# EAGLE schematic Underwater-Camera-v2.0 (EAGLE 9.4.0)

## Sheet 1 of 2
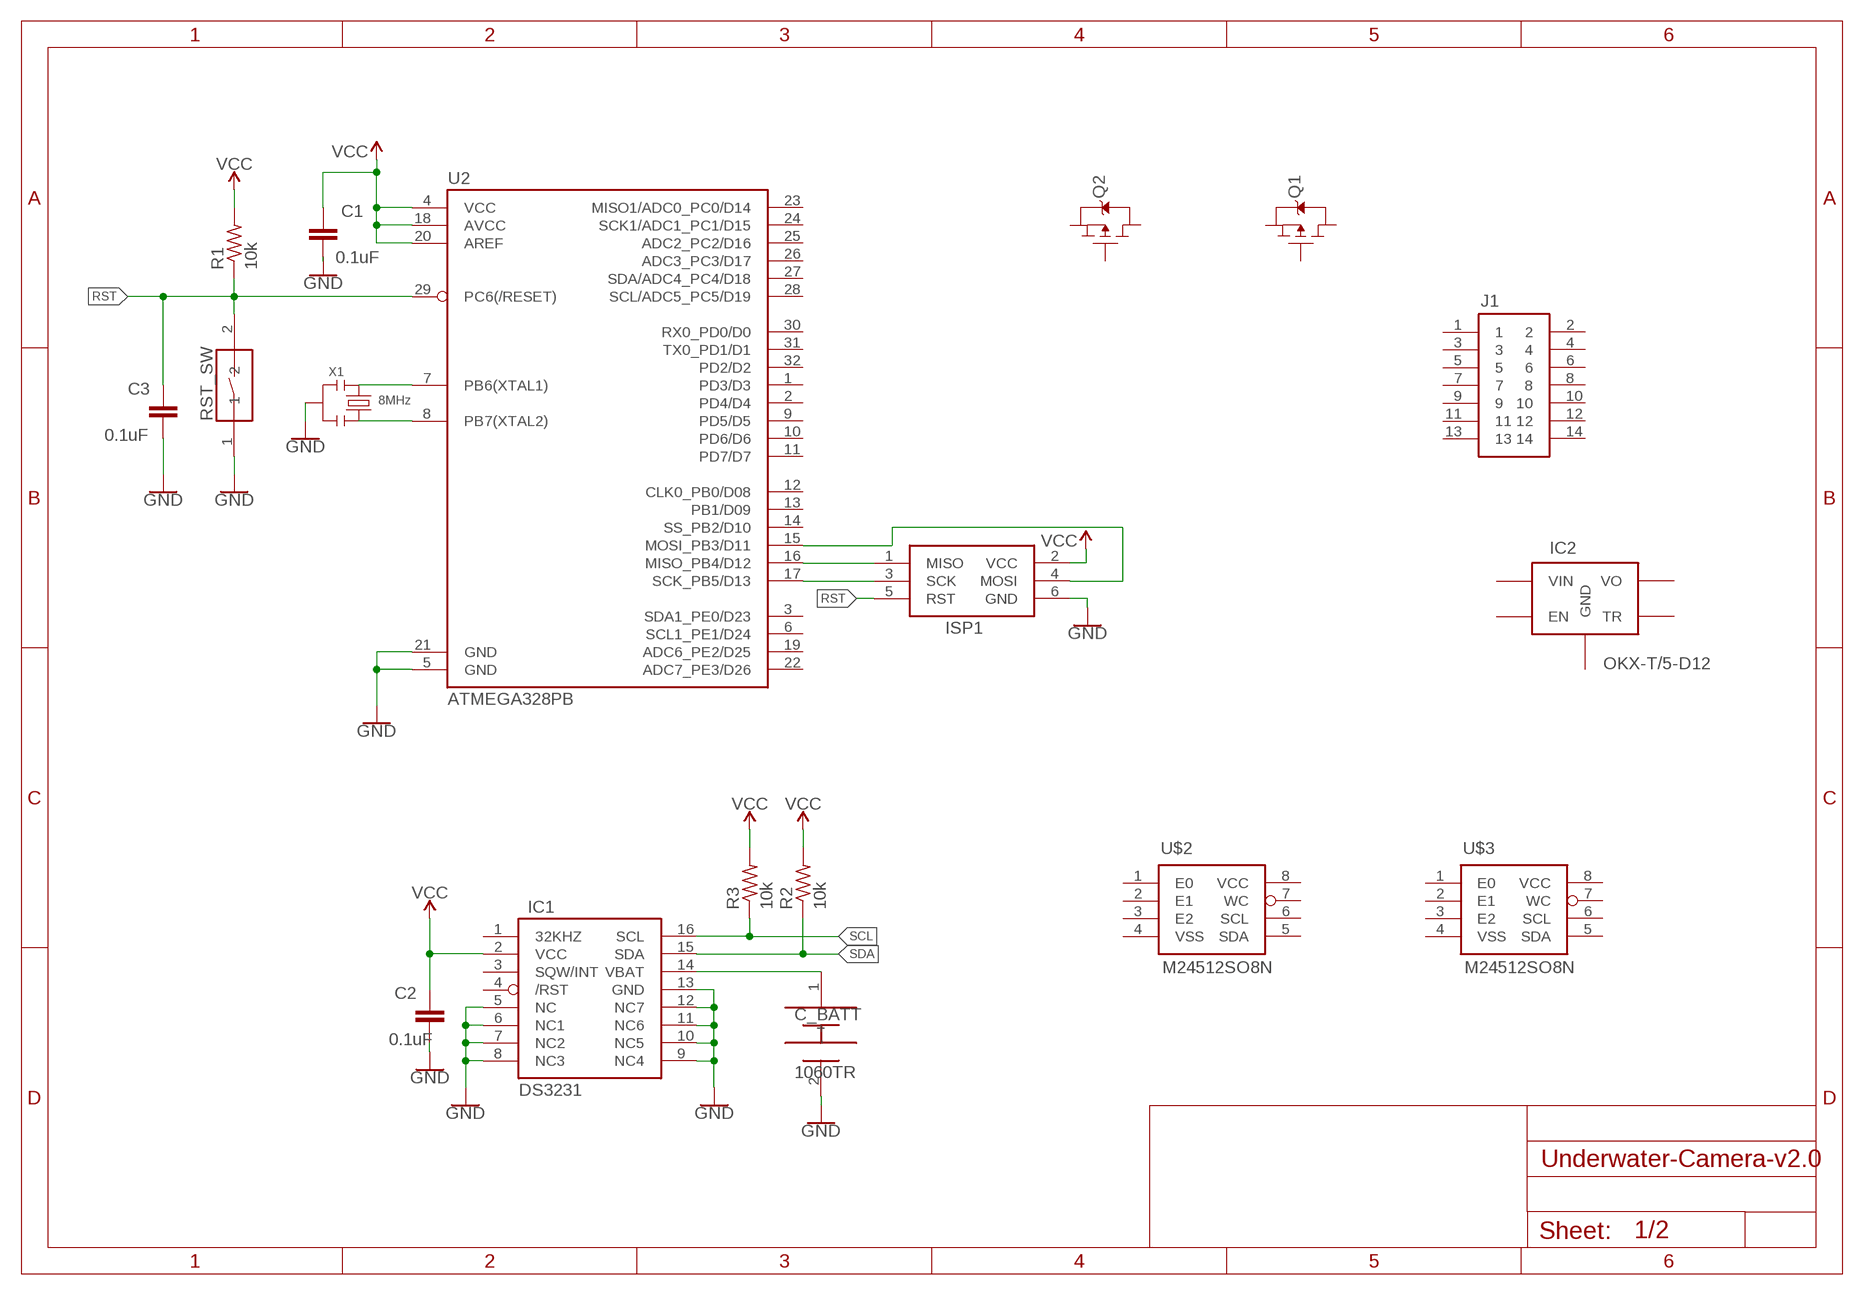
[diagram p0: schematic, sheet 1]

### Parts
C1  0.1uF  CAPACITOR_CERAMIC0603  [CAPC1608X50]
C2  0.1uF  CAPACITOR_CERAMIC0603  [CAPC1608X50]
C3  0.1uF  CAPACITOR_CERAMIC0603  [CAPC1608X50]
C_BATT  1060TR  [RESC26736X10]
IC1  DS3231SOIC-16  [SOIC127P1135X265-16]
IC2  OKX-T/5-D12  [HDRV9W64P254_1X9_2290X508X838B]
ISP1  AVR_ISPHDR2X3  [HDRV6W64P254_2X3_1016X508X838B]
J1  HDR2X7HDR2X7  [HDRV14W64P254_2X7_1778X508X838B]
Q1  DMG2305UXSOT23  [SOT95P240X110-3]
Q2  DMG2305UXSOT23  [SOT95P240X110-3]
R1  10k  RESISTOR0603  [RESC1608X50]
R2  10k  RESISTOR0603  [RESC1608X50]
R3  10k  RESISTOR0603  [RESC1608X50]
RST_SW  SWITCHB3U-1000P  [BEADC4225X160]
U2  ATMEGA328PB  ATMEGA328P  [QFP80P900X900X120-32]
U$2  M24512SO8N  [SOIC127P600X175-8]
U$3  M24512SO8N  [SOIC127P600X175-8]
X1  8MHz  CERAMIC_RESONATOR  [RESCAXE120P320X130X70-6]

### Nets
GND: C1.2 C2.2 C3.2 C_BATT.2(-) IC1.5(NC) IC1.6(NC1) IC1.7(NC2) IC1.8(NC3) IC1.9(NC4) IC1.10(NC5) IC1.11(NC6) IC1.12(NC7) IC1.13(GND) ISP1.6(GND) RST_SW.1 U2.5(GND) U2.21(GND) X1.2 X1.5
N$1: U2.7(PB6(XTAL1)) X1.1 X1.6
N$2: U2.8(PB7(XTAL2)) X1.3 X1.4
N$3: ISP1.3(SCK) U2.17(SCK_PB5/D13)
N$4: ISP1.1(MISO) U2.16(MISO_PB4/D12)
N$5: ISP1.4(MOSI) U2.15(MOSI_PB3/D11)
N$6: C_BATT.1(+) IC1.14(VBAT)
RST: C3.1 ISP1.5(RST) R1.1 RST_SW.2 U2.29(PC6(/RESET))
SCL: IC1.16(SCL) R3.1
SDA: IC1.15(SDA) R2.1
VCC: C1.1 C2.1 IC1.2(VCC) ISP1.2(VCC) R1.2 R2.2 R3.2 U2.4(VCC) U2.18(AVCC) U2.20(AREF)
Unconnected: IC1.1(32KHZ) IC1.3(SQW/INT) IC1.4(/RST) IC2.1(VO) IC2.2(TR) IC2.3(GND) IC2.8(VIN) IC2.9(EN) J1.1 J1.2 J1.3 J1.4 J1.5 J1.6 J1.7 J1.8 J1.9 J1.10 J1.11 J1.12 J1.13 J1.14 Q1.1(G) Q1.2(S) Q1.3(D) Q2.1(G) Q2.2(S) Q2.3(D) U2.1(PD3/D3) U2.2(PD4/D4) U2.3(SDA1_PE0/D23) U2.6(SCL1_PE1/D24) U2.9(PD5/D5) U2.10(PD6/D6) U2.11(PD7/D7) U2.12(CLK0_PB0/D08) U2.13(PB1/D09) U2.14(SS_PB2/D10) U2.19(ADC6_PE2/D25) U2.22(ADC7_PE3/D26) U2.23(MISO1/ADC0_PC0/D14) U2.24(SCK1/ADC1_PC1/D15) U2.25(ADC2_PC2/D16) U2.26(ADC3_PC3/D17) U2.27(SDA/ADC4_PC4/D18) U2.28(SCL/ADC5_PC5/D19) U2.30(RX0_PD0/D0) U2.31(TX0_PD1/D1) U2.32(PD2/D2) U$2.1(E0) U$2.2(E1) U$2.3(E2) U$2.4(VSS) U$2.5(SDA) U$2.6(SCL) U$2.7(WC) U$2.8(VCC) U$3.1(E0) U$3.2(E1) U$3.3(E2) U$3.4(VSS) U$3.5(SDA) U$3.6(SCL) U$3.7(WC) U$3.8(VCC)

## Sheet 2 of 2
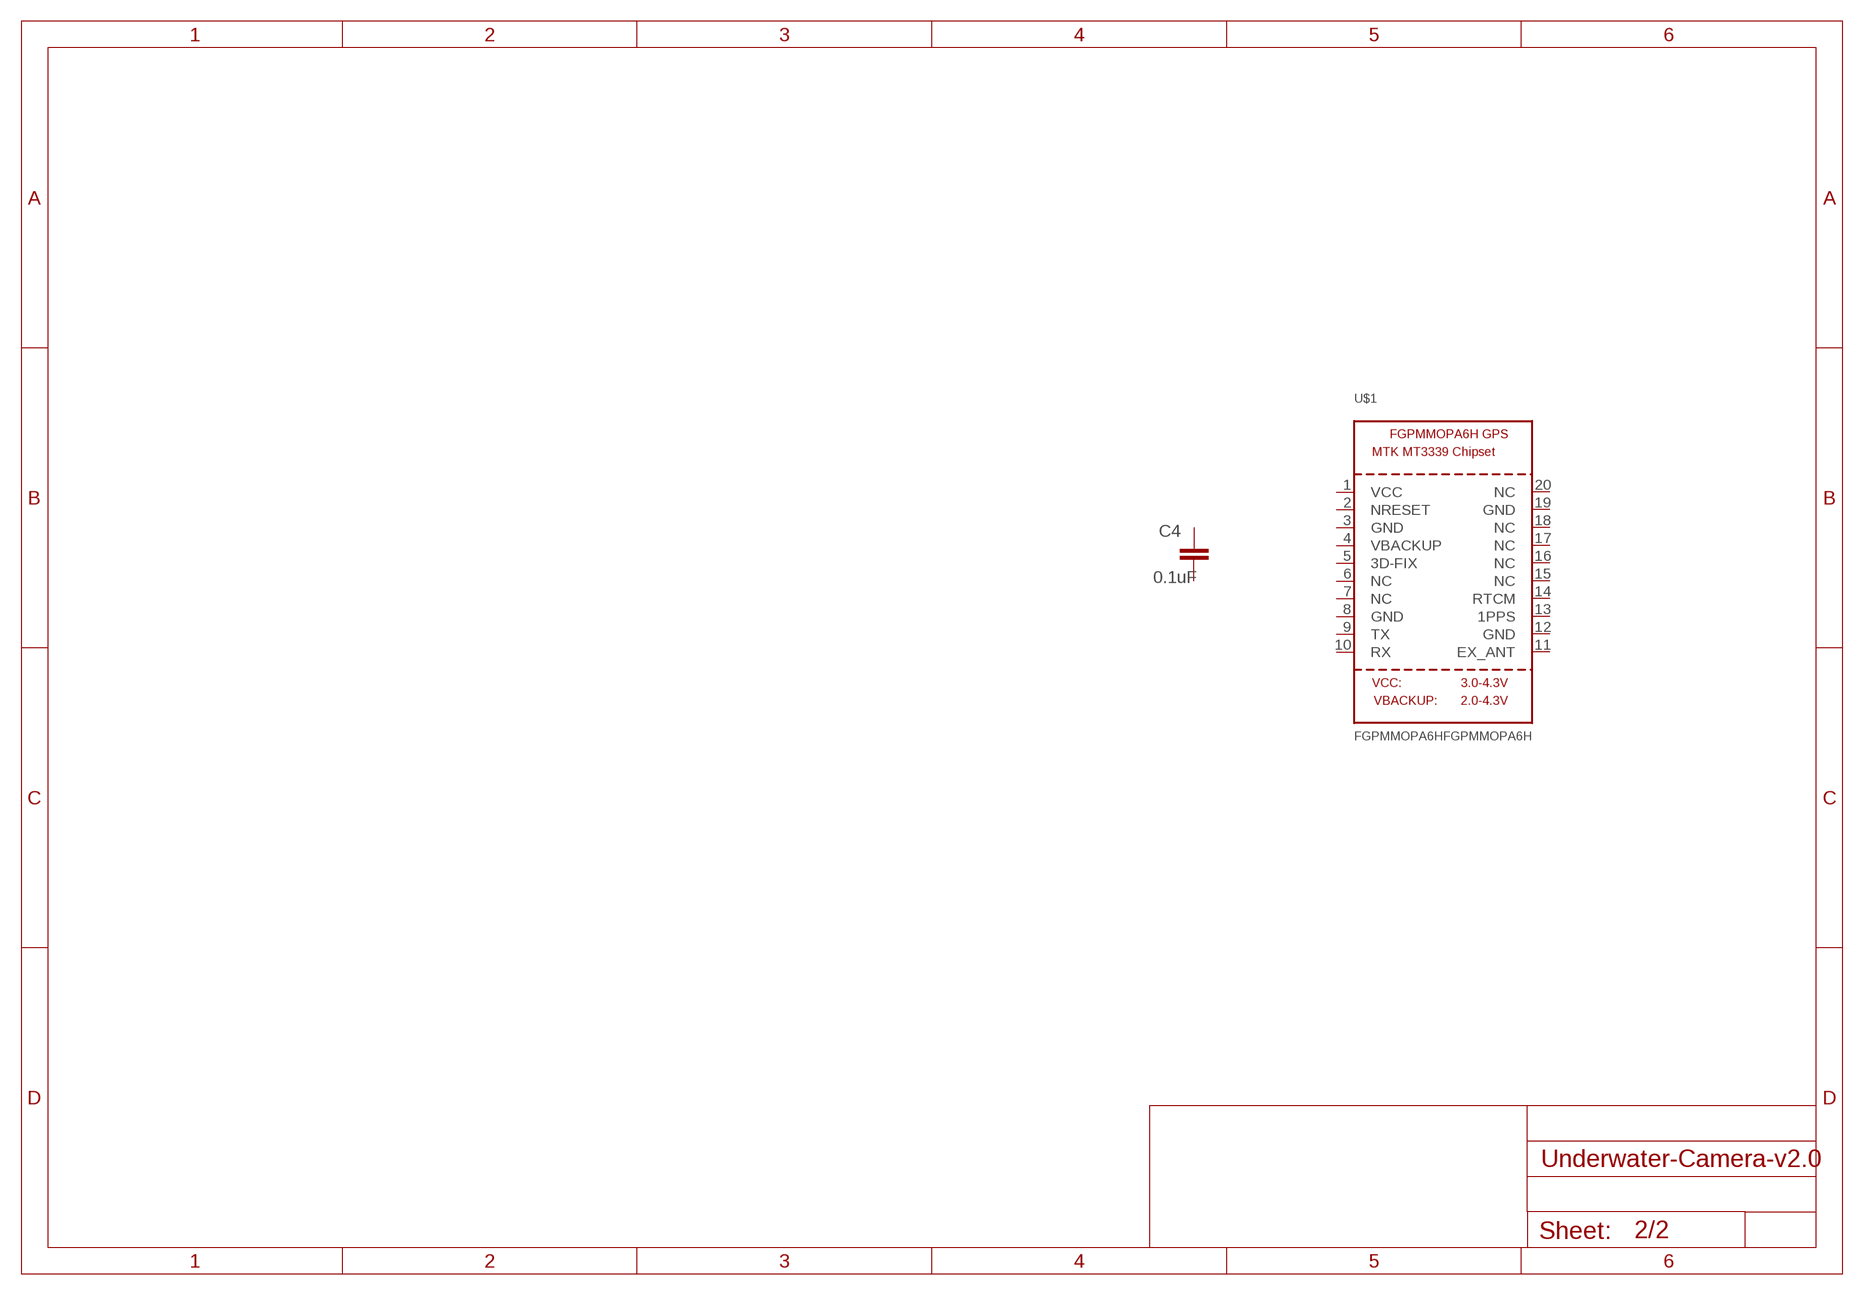
[diagram p1: schematic, sheet 2]

### Parts
C4  0.1uF  CAPACITOR_CERAMIC0603  [CAPC1608X50]
U$1  FGPMMOPA6HFGPMMOPA6H  [SON150P1800X1800X500-20]
Unconnected: C4.1 C4.2 U$1.1(VCC) U$1.2(NRESET) U$1.3(GND) U$1.4(VBACKUP) U$1.5(3D-FIX) U$1.6(NC) U$1.7(NC) U$1.8(GND) U$1.9(TX) U$1.10(RX) U$1.11(EX_ANT) U$1.12(GND) U$1.13(1PPS) U$1.14(RTCM) U$1.15(NC) U$1.16(NC) U$1.17(NC) U$1.18(NC) U$1.19(GND) U$1.20(NC)

## Library data of the parts
C1-C4 = Underwater-Camera-v2.0:CAPACITOR_CERAMIC: Ceramic Capacitor MLCC - Symbol US
C_BATT = Underwater-Camera-v2.0:1060TR: CR2032 Coin Cell Battery Holder
IC1 = Underwater-Camera-v2.0:DS3231: The DS3231 is a low-cost, extremely accurate I2C real-time clock (RTC) with an integrated temperaturecompensated crystal oscillator (TCXO) and crystal.
IC2 = Underwater-Camera-v2.0:OKX-T/5-D12: OKX-T/5-D12 by Murata Inc. - Monolithic DC/DC Converter input: 8.3-13.8v output: <5.5v adjustable current: 5A power: 25W
ISP1 = Underwater-Camera-v2.0:AVR_ISP: AVR ISP PROGRAMMING HEADER
J1 = Underwater-Camera-v2.0:HDR2X7
Q1 Q2 = Underwater-Camera-v2.0:DMG2305UX: DMG2305UX-13 Diodes Incorporated MOSFET P-CH 20V 4.2A SOT23
R1-R3 = Underwater-Camera-v2.0:RESISTOR: Resistor US
RST_SW = Underwater-Camera-v2.0:SWITCH: SWITCH SPST
U2 = Underwater-Camera-v2.0:ATMEGA328P: IC MCU 8BIT 32KB FLASH 32TQFP
U$1 = Underwater-Camera-v2.0:FGPMMOPA6H: -165 dBm sensitivity, 10 Hz updates, 66 channels Ultra low power usage: 20mA current draw while tracking 3.3V operation RTC battery-compatible Built-in datalogging PPS output on fix We have received reports that it works up to ~32Km altitude (the GPS theoretically does not have a limit until 40Km) Internal patch antenna + connection for optional external active antenna Fix status output Ultra small size: only 16mm x 16mm x 5mm and 4 grams
U$2 U$3 = Underwater-Camera-v2.0:M24512: The M24512 is a 512-Kbit I2C-compatible EEPROM (Electrically Erasable PROgrammable Memory) organized as 64 K × 8 bits.
X1 = Underwater-Camera-v2.0:CERAMIC_RESONATOR: Ceramic Resonator - 3pins - built in load capacitors